# EAGLE design whammy-schematic (EAGLE 8.4.3)
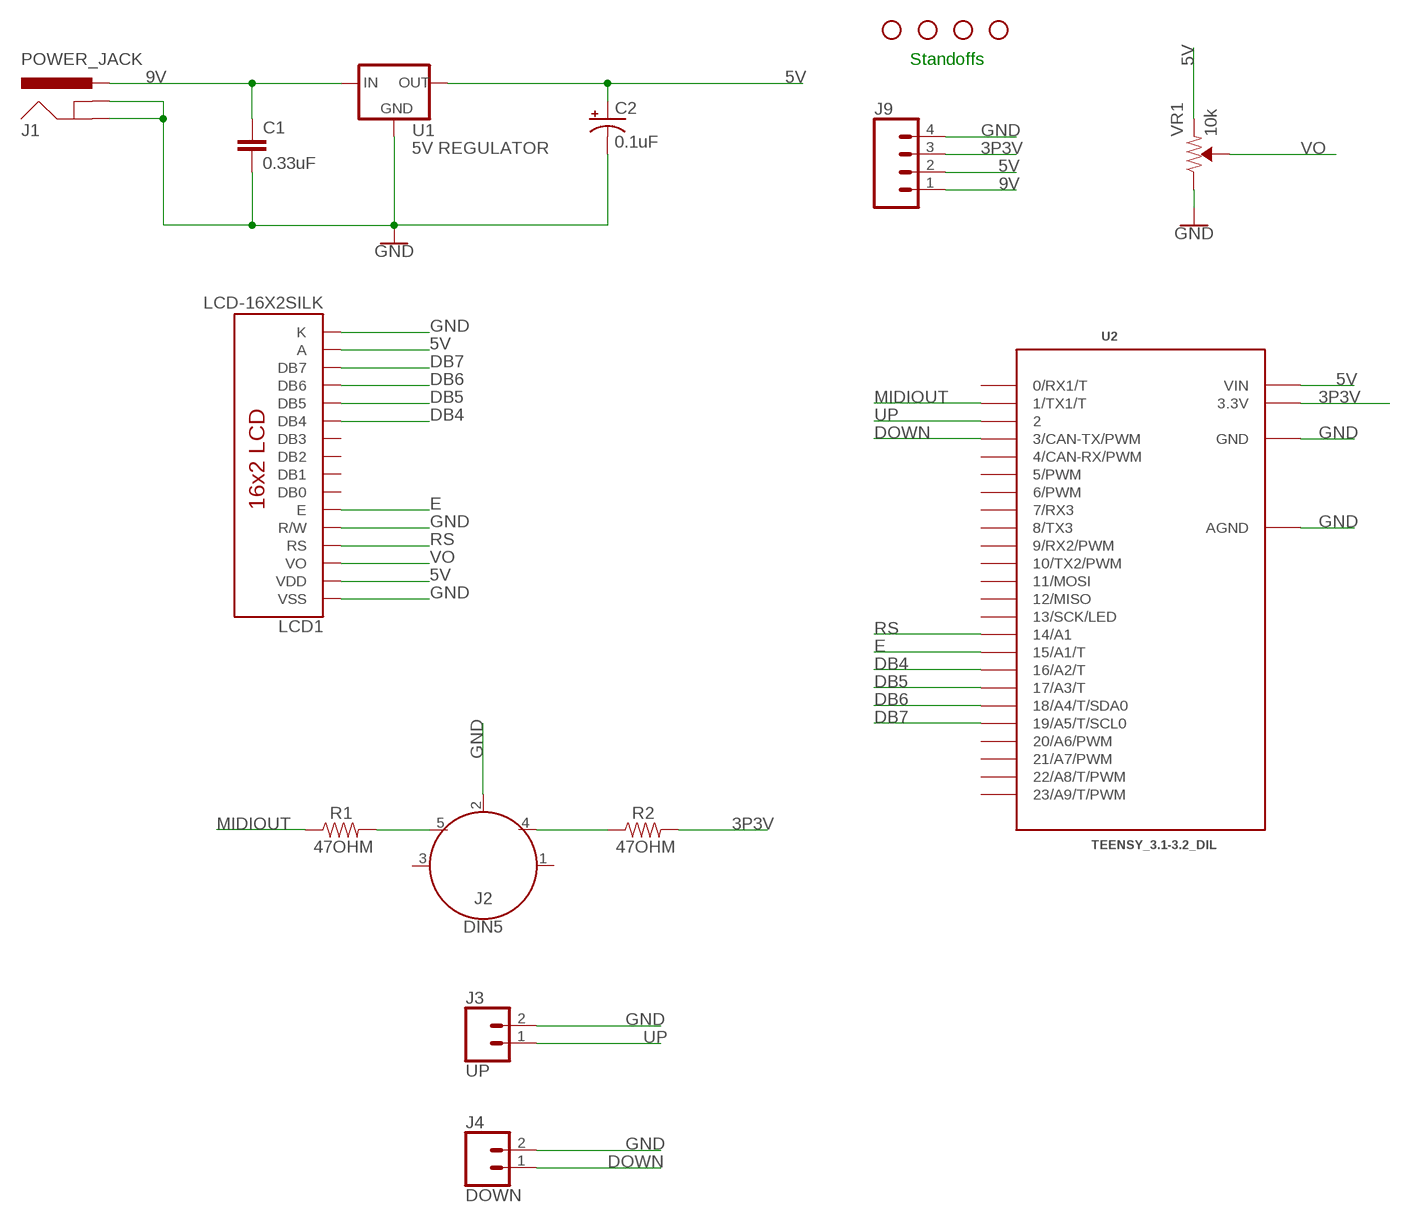
[diagram p0: schematic, sheet 1]

## Parts
C1  0.33uF  22PF-PTH-2.54MM-200V-5%  [CAP-PTH-2.54]
C2  0.1uF  10UF-POLAR-RADIAL-2.5MM-25V-20%  [CPOL-RADIAL-2.5MM-5MM]
H1  STAND-OFF  [STAND-OFF]
H2  STAND-OFF  [STAND-OFF]
H3  STAND-OFF  [STAND-OFF]
H4  STAND-OFF  [STAND-OFF]
J1  POWER_JACK  [POWER_JACK_PTH]
J2  DIN5  [DIN5-RA-PTH]
J3  UP  CONN_02  [1X02]
J4  DOWN  CONN_02  [1X02]
J9  CONN_04  [1X04]
LCD1  LCD-16X2SILK  [LCD-16X2]
R1  47OHM  RESISTORAXIAL-0.3-KIT  [AXIAL-0.3-KIT]
R2  47OHM  RESISTORAXIAL-0.3-KIT  [AXIAL-0.3-KIT]
U1  5V REGULATOR  V_REG_78XX-TO-220  [TO-220-ALT]
U2  TEENSY_3.1-3.2_DIL  [TEENSY_3.0-3.2&LC_DIL]
VR1  10k  TRIMPOT-PTH-10MM-KNOB-1/2W-10%  [TRIMPOT-PTH-3386U]

## Nets
3P3V: J9.3 R2.P$2 U2.3.3V
5V: C2.1(+) J9.2 LCD1.2(VDD) LCD1.15(A) U1.OUT U2.VIN VR1.1(CCW)
9V: C1.1 J1.PWR J9.1 U1.IN
DB4: LCD1.11(DB4) U2.16/A2(16/A2/T)
DB5: LCD1.12(DB5) U2.17/A3(17/A3/T)
DB6: LCD1.13(DB6) U2.18/A4(18/A4/T/SDA0)
DB7: LCD1.14(DB7) U2.19/A5(19/A5/T/SCL0)
DOWN: J4.1 U2.3(3/CAN-TX/PWM)
E: LCD1.6(E) U2.15/A1(15/A1/T)
GND: C1.2 C2.2(-) J1.GND J1.GNDBREAK J2.2 J3.2 J4.2 J9.4 LCD1.1(VSS) LCD1.5(R/W) LCD1.16(K) U1.GND U2.AGND U2.GND VR1.3(CW)
MIDIOUT: R1.P$1 U2.1(1/TX1/T)
N$1: J2.5 R1.P$2
N$2: J2.4 R2.P$1
RS: LCD1.4(RS) U2.14/A0(14/A1)
UP: J3.1 U2.2
VO: LCD1.3(VO) VR1.2(WIPER)
Unconnected: J2.1 J2.3 LCD1.7(DB0) LCD1.8(DB1) LCD1.9(DB2) LCD1.10(DB3) U2.0(0/RX1/T) U2.4(4/CAN-RX/PWM) U2.5(5/PWM) U2.6(6/PWM) U2.7(7/RX3) U2.8(8/TX3) U2.9(9/RX2/PWM) U2.10(10/TX2/PWM) U2.11(11/MOSI) U2.12(12/MISO) U2.13(13/SCK/LED) U2.20/A6(20/A6/PWM) U2.21/A7(21/A7/PWM) U2.22/A8(22/A8/T/PWM) U2.23/A9(23/A9/T/PWM)

## Notes on the sheet
- Standoffs

## Library data of the parts
C1 = SparkFun-Capacitors:22PF: 22pF ceramic capacitors A capacitor is a passive two-terminal electrical component used to store electrical energy temporarily in an electric field.; PROD_ID: CAP-09128; VALUE: 22pF
C2 = SparkFun-Capacitors:10UF-POLAR: 10.0µF polarized capacitors A capacitor is a passive two-terminal electrical component used to store electrical energy temporarily in an electric field.; PROD_ID: CAP-08440; VALUE: 10uF
H1-H4 = SparkFun-Hardware:STAND-OFF: Stand Off Drill holes for mechanically mounting via screws, standoffs, etc. Note: Use the keepout ring to avoid running the screw head into surrounding components. Variant Overviews STAND-OFF - Mechanical footprint for a #4 phillips button head screw. STAND-OFF-TIGHT - Mechanical footprint for a #4 phillips button head screw, Example SparkFun Products Screw - Phillips Head (1/4", 4-40, 10 pack) <https://www.sparkfun.com/products/10453> (PRT-10453) Screw - Phillips Head (1/2", 4-40, 10 pack) <https://www.sparkfun.com/products/10452> (PRT-10452) Screw - Phillips Head (3/4", 4-40, 10 pack) <https://www.sparkfun.com/products/10451> (PRT-10451) Screw - Phillips Head (1", 4-40, 10 pack) <https://www.sparkfun.com/products/10450> (PRT-10450)
J1 = SparkFun-Connectors:POWER_JACK: Power Jack Connector This is the standard 5.5mm barrel jack for power. The PTH is the most common, proven, reliable, footprint. The Slot footprint only works if the mill layer is transmitted to the PCB fab house so be warned. Here are the connectors we sell at SparkFun: DC Barrel Power Jack/Connector <https://www.sparkfun.com/products/119> (PRT-00119) DC Barrel Power Jack/Connector (SMD) <https://www.sparkfun.com/products/12748> (PRT-12748) DC Barrel Jack Adapter - Breadboard Compatible <https://www.sparkfun.com/products/10811> (PRT-10811) It is used on this SparkFun product (and many, many others): SparkFun RedBoard - Programmed with Arduino <https://www.sparkfun.com/products/12757> (DEV-12757) Also, if you need a mating power supply or connector, please check these out: Wall Adapter Power Supply - 9VDC 650mA <https://www.sparkfun.com/products/298> (TOL-00298) DC Barrel Jack Adapter - Male <https://www.sparkfun.com/products/10287> (PRT-10287); PROD_ID: CONN-08197
J2 = SparkFun-Connectors:DIN5: DIN5 Connector - Female Right Angle (frequently used as a MIDI Jack connector) This type of connector and cable is frequently used for transmitting midi data (musical instrument digital interface). It is what you usually see on a keyboard or set of electronic drums. Learn more here <https://en.wikipedia.org/wiki/MIDI>. For more information on the pinout and electrical specifications of MIDI communications, please see the following resource: https://www.midi.org/specifications/item/midi-din-electrical-specification Here is the connector we sell at SparkFun: MIDI Connector - Female Right Angle <https://www.sparkfun.com/products/9536> (PRT-09536) Datasheet <hhttp://www.sparkfun.com/datasheets/Prototyping/Connectors/MIDI-RA.pdf> It is used on this SparkFun product: SparkFun MIDI Shield <https://www.sparkfun.com/products/12898> (DEV-12898); PROD_ID: CONN-09481
J3 J4 = SparkFun-Connectors:CONN_02: Multi connection point. Often used as Generic Header-pin footprint for 0.1 inch spaced/style header connections On any of the 0.1 inch spaced packages, you can populate with these: Break Away Headers - Straight <https://www.sparkfun.com/products/116> (PRT-00116) Break Away Male Headers - Right Angle <https://www.sparkfun.com/products/553> (PRT-00553) Female Headers <https://www.sparkfun.com/products/115> (PRT-00115) Break Away Headers - Machine Pin <https://www.sparkfun.com/products/117> (PRT-00117) Break Away Female Headers - Swiss Machine Pin <https://www.sparkfun.com/products/743> (PRT-00743) For SCREWTERMINALS and SPRING TERMINALS visit here: Screw Terimnals on SparkFun.com <https://www.sparkfun.com/search/results?term=Screw+Terminals> (5mm/3.5mm/2.54mm spacing) This device is also useful as a general connection point to wire up your design to another part of your project. Our various solder wires solder well into these plated through hole pads. Hook-Up Wire - Assortment (Stranded, 22 AWG) <https://www.sparkfun.com/products/11375> (PRT-11375) Hook-Up Wire - Assortment (Solid Core, 22 AWG) <https://www.sparkfun.com/products/11367> (PRT-11367) View the entire wire category on our website here <https://www.sparkfun.com/categories/141> Special notes: Molex polarized connector foot print use with: PRT-08233 with associated crimp pins and housings. 2.54_SCREWTERM for use with PRT-10571. 3.5mm Screw Terminal footprints for PRT-08084 5mm Screw Terminal footprints for use with PRT-08432
J9 = SparkFun-Connectors:CONN_04: Multi connection point. Often used as Generic Header-pin footprint for 0.1 inch spaced/style header connections On any of the 0.1 inch spaced packages, you can populate with these: Break Away Headers - Straight <https://www.sparkfun.com/products/116> (PRT-00116) Break Away Male Headers - Right Angle <https://www.sparkfun.com/products/553> (PRT-00553) Female Headers <https://www.sparkfun.com/products/115> (PRT-00115) Break Away Headers - Machine Pin <https://www.sparkfun.com/products/117> (PRT-00117) Break Away Female Headers - Swiss Machine Pin <https://www.sparkfun.com/products/743> (PRT-00743) For SCREWTERMINALS and SPRING TERMINALS visit here: Screw Terimnals on SparkFun.com <https://www.sparkfun.com/search/results?term=Screw+Terminals> (5mm/3.5mm/2.54mm spacing) This device is also useful as a general connection point to wire up your design to another part of your project. Our various solder wires solder well into these plated through hole pads. Hook-Up Wire - Assortment (Stranded, 22 AWG) <https://www.sparkfun.com/products/11375> (PRT-11375) Hook-Up Wire - Assortment (Solid Core, 22 AWG) <https://www.sparkfun.com/products/11367> (PRT-11367) View the entire wire category on our website here <https://www.sparkfun.com/categories/141> Special notes: Molex polarized connector foot print use with SKU : PRT-08231 with associated crimp pins and housings. 1MM SMD Version SKU: PRT-10208; PROD_ID: CONN-09696
LCD1 = SparkFun-Displays:LCD-16X2: Standard text-only 16x2 parallel input LCD Basic 16 character by 2 line display. Typically utilizes the extremely common HD44780 parallel interface chipset SparkFun Products: Basic 16x2 Green <https://www.sparkfun.com/products/255> Basic 8x2 Green <https://www.sparkfun.com/products/11122>; SF_ID: LCD-00255
R1 R2 = SparkFun-Resistors:RESISTOR: Generic Resistor Package
U1 = SparkFun-IC-Power:V_REG_78XX: Voltage Regulator Standard 78xx regulator. IGO (Input Ground Output). Spark Fun Electronics SKU : COM-00107; PROD_ID: VREG-08450; SF_ID: COM-00107
U2 = Teensy_3_and_LC_Series_Boards_v1.4:TEENSY_3.1-3.2_DIL: Teensy 3.1 or 3.2 in a DIL Layout.
VR1 = SparkFun-Resistors:TRIMPOT: Trimming Potentiometer (Trimpot) Three-terminal potentiometers, with an adjustable wiper and two adjustable resistors. A pot can be used to create a configurable voltage divider, or as a variable resistor. "Trimpots" are a subset of potentiometers, usually intended for "set-and-forget" applications. They're often more delicate than standard potentiometers - rated for fewer turns. Variants PTH-KNOB - PTH Trimpot w/ finger-adjustable knob Trimpot 10K with Knob <https://www.sparkfun.com/products/9806> (COM-09806) Datasheet <http://www.sparkfun.com/datasheets/Components/General/TSR-3386.pdf> SMD-3MM-CLOSED-FRAME - SMD 3mm Square Closed-Frame Trimpot Used on e.g. EasyDriver - Stepper Motor Driver <https://www.sparkfun.com/products/12779> Datasheet <http://www.bitechnologies.com/pdfs/22.pdf> (22AR10KTR) SMD-5MM - SMD 5mm Square Closed-Frame Trimpot Used on e.g. IOIO-OTG - V2.2 <https://www.sparkfun.com/products/13613> Datasheet <http://www.vishay.com/docs/51008/ts53.pdf> (TS53YL502MR10) SMD-3MM-1/10W-25% - 3mm Square Open-Frame Trimpot Used on e.g. SparkFun Shapeoko <https://www.sparkfun.com/products/13899> Datasheet <http://www.bourns.com/docs/Product-Datasheets/TC33.pdf> (TC33X-2-103E); PROD_ID: RES-09730; SF_SKU: COM-09806

## Board
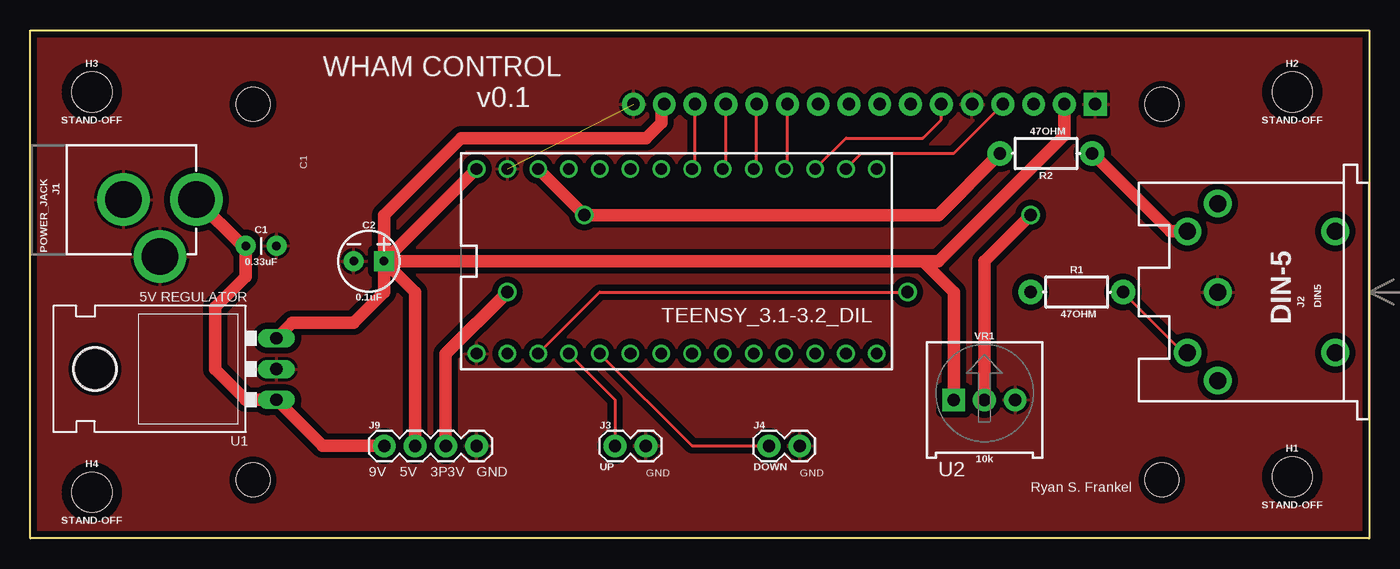
[diagram p1: board, top side]
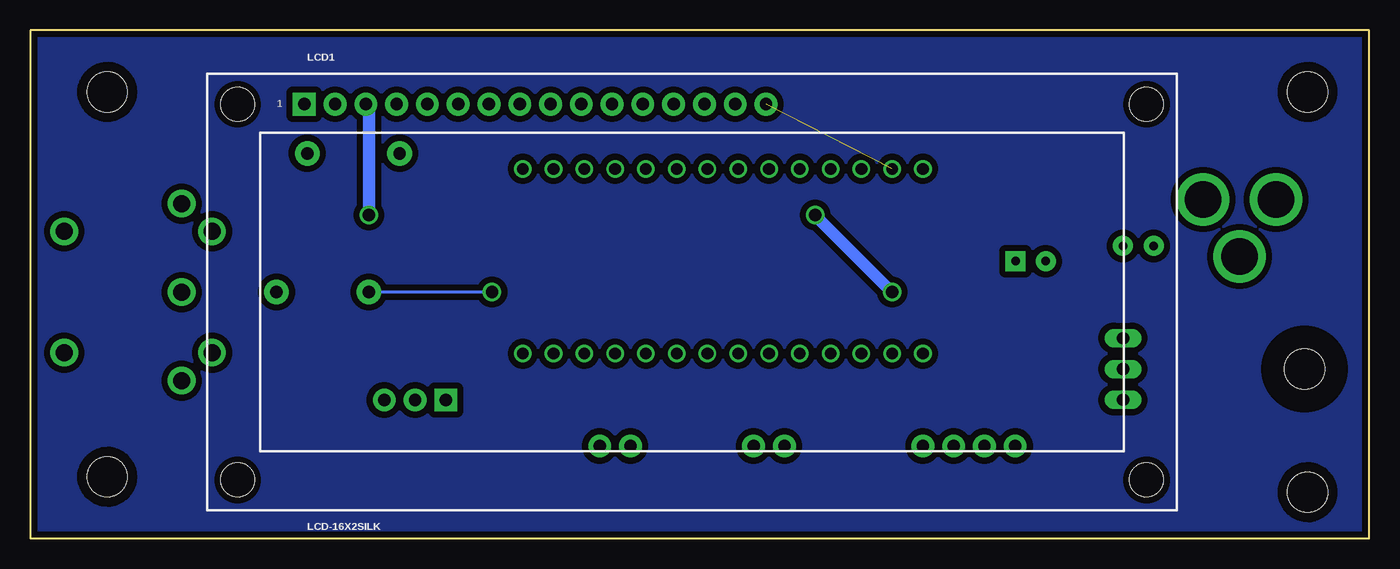
[diagram p2: board, bottom side, seen from below]

Size 110.49 x 41.91 mm. Coordinates in mm from the lower left corner, seen from the top.
Outline: 0,0 0,41.91 110.49,41.91 110.49,0 0,0
Copper layers (1*16): Top 0.035559375mm / dielectric 1.6mm / Bottom 0.035559375mm
Design rules "oshpark-2layer *": minimum track width 6mil, minimum drill 10mil, track to track 6mil, track to pad 6mil, pad to pad 6mil, via to via 6mil, smd to smd 6mil, copper to edge 15mil, drill to drill 6mil, minimum pad ring 5mil, minimum via ring 5mil, stop-mask expansion 2.5mil, vias tented up to drill 10mil, thermal gap 10mil

### Footprints (pad centres in the part's own frame; a part is rotated, then mirrored left to right if it is on the bottom)
CAP-PTH-2.54 = drill 0.7 pad 1.651: 1 -1.27,0; 2 1.27,0
CPOL-RADIAL-2.5MM-5MM = drill 0.7 pad 1.651 square: 1 1.25,0 | drill 0.7 pad 1.651: 2 -1.25,0
STAND-OFF = hole 3.302: 0,0
POWER_JACK_PTH = drill 2.997 pad 4.318: GND 0,7.7; GNDBREAK 4.7,10.7; PWR 0,13.7
DIN5-RA-PTH = drill 1.4 pad 2.286: 1 7.3,12.5; 2 0,12.5; 3 -7.3,12.5; 4 5,15; 5 -5,15; 6 -5,2.8; 7 5,2.8
1X02 = drill 1.016 pad 1.88: 1 0,0; 2 2.54,0
1X04 = drill 1.016 pad 1.88: 1 0,0; 2 2.54,0; 3 5.08,0; 4 7.62,0
LCD-16X2 = drill 1.016 pad 1.88 square: 1 -32,15.5 | drill 1.016 pad 1.88: 2 -29.46,15.5; 3 -26.92,15.5; 4 -24.38,15.5; 5 -21.84,15.5; 6 -19.3,15.5; 7 -16.76,15.5; 8 -14.22,15.5; 9 -11.68,15.5; 10 -9.14,15.5; 11 -6.6,15.5; 12 -4.06,15.5; 13 -1.52,15.5; 14 1.02,15.5; 15 3.56,15.5; 16 6.1,15.5 | hole 2.8: -37.5,15.5; -37.5,-15.5; 37.5,15.5; 37.5,-15.5
AXIAL-0.3-KIT = drill 1.016 pad 2.032: P$1 -3.81,0; P$2 3.81,0
TO-220-ALT = drill 1.016 long: GND 0,-3.81; IN -2.54,-3.81; OUT 2.54,-3.81 | hole 3.302: 0,11.176
TEENSY_3.0-3.2&LC_DIL = drill 0.965: 0 -7.62,13.97; 1 -7.62,11.43; 2 -7.62,8.89; 3 -7.62,6.35; 3.3V 7.62,11.43; 4 -7.62,3.81; 5 -7.62,1.27; 6 -7.62,-1.27; 7 -7.62,-3.81; 8 -7.62,-6.35; 9 -7.62,-8.89; 10 -7.62,-11.43; 11 -7.62,-13.97; 12 -7.62,-16.51; 13 7.62,-16.51; 14/A0 7.62,-13.97; 15/A1 7.62,-11.43; 16/A2 7.62,-8.89; 17/A3 7.62,-6.35; 18/A4 7.62,-3.81; 19/A5 7.62,-1.27; 20/A6 7.62,1.27; 21/A7 7.62,3.81; 22/A8 7.62,6.35; 23/A9 7.62,8.89; AGND 7.62,13.97; GND -7.62,16.51; VIN 7.62,16.51
TRIMPOT-PTH-3386U = drill 1.016 pad 1.88 square: 1 -2.54,-0.015 | drill 1.016 pad 1.88: 2 0,-0.015; 3 2.54,-0.015

### Placement (x,y rotation side)
C1  19.05,24.13 0 top
C2  27.94,22.86 0 top
H1  104.14,5.08 0 top
H2  104.14,36.83 0 top
H3  5.08,36.83 0 top
H4  5.08,3.81 0 top
J1  0,27.94 270 top
J2  110.49,20.32 90 top
J3  48.26,7.62 0 top
J4  60.96,7.62 0 top
J9  29.21,7.62 0 top
LCD1  55.88,20.32 0 bottom
R1  86.36,20.32 0 top
R2  83.82,31.75 180 top
U1  16.51,13.97 90 top
U2  53.34,22.86 90 top
VR1  78.74,11.43 0 top

### Tracks (layer width: path | path; a pad name or v marks a point on that pad's centre or on a via)
3P3V  (via drill 1.02)
  Top 1.016: R2.P$2 74.93,26.67 v45.72,26.67 U2.3.3V | v39.37,20.32 34.29,15.24 J9.3
  Bottom 1.016: v45.72,26.67 v39.37,20.32
5V
  Top 1.016: U1.OUT 21.59,17.78 26.67,17.78 29.19,20.3 C2.1 | C2.1 31.75,20.3 J9.2 | C2.1 36.81,30.48 U2.VIN | C2.1 29.19,26.65 35.56,33.02 50.8,33.02 52.07,34.29 52.07,35.57 LCD1.15 | 72.39,22.86 C2.1 | 72.39,22.86 74.93,22.86 85.34,33.27 LCD1.2 | VR1.1 76.2,20.32 73.66,22.86 72.39,22.86
9V
  Top 1.016: J9.1 24.13,7.62 U1.IN 17.78,11.43 15.24,13.97 15.24,19.05 17.78,21.59 C1.1 17.51,24.13 J1.PWR
DB4
  Top 0.254: U2.16/A2 62.48,30.73 LCD1.11
DB5
  Top 0.254: U2.17/A3 59.94,30.73 LCD1.12
DB6
  Top 0.254: U2.18/A4 57.4,30.73 LCD1.13
DB7
  Top 0.254: U2.19/A5 54.86,30.73 LCD1.14
DOWN
  Top 0.254: U2.3 54.61,7.62 J4.1
E
  Top 0.254: U2.15/A1 67.31,33.02 73.66,33.02 75.18,34.54 LCD1.6
GND  (1 unrouted)
  pour Top (isolate 0.508): 0,41.91 0,0 110.49,0 110.49,41.91
MIDIOUT  (via drill 1.02)
  Top 0.254: U2.1 46.99,20.32 v72.39,20.32
  Bottom 0.254: v72.39,20.32 R1.P$1
N$1
  Top 0.254: R1.P$2 95.17,15.32 J2.5
N$2
  Top 1.016: R2.P$1 94.06,25.32 J2.4
N$3
  pour Bottom (isolate 0.508): 0,41.91 0,0 110.49,0 110.49,41.91
RS
  Top 0.254: U2.14/A0 68.58,31.75 76.2,31.75 LCD1.4
UP
  Top 0.254: U2.2 48.26,11.43 J3.1
VO  (via drill 1.02)
  Top 1.016: v82.55,26.67 78.74,22.86 VR1.2
  Bottom 1.016: LCD1.3 82.55,35.57 v82.55,26.67

### Text on the board
tPlace: WHAM CONTROL | v0.1 | C1 | 9V | 5V | 3P3V | GND | GND | GND | Ryan S. Frankel
bNames: 1